# EAGLE design dc (EAGLE 9.2.2)
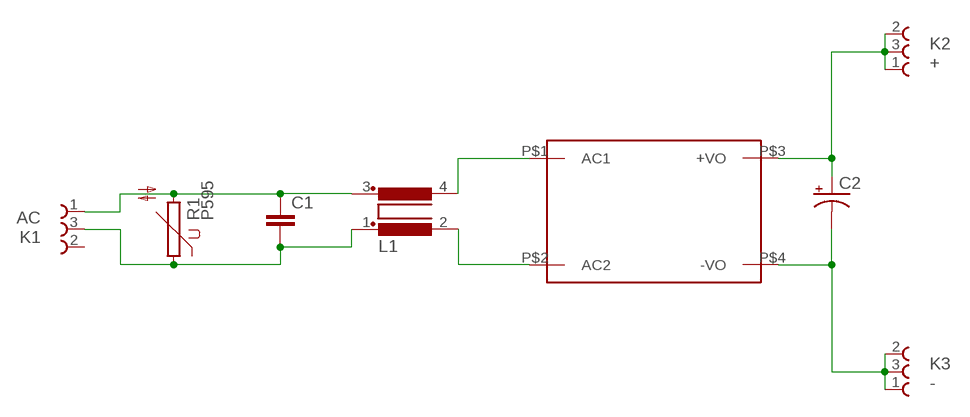
[diagram p0: schematic, sheet 1]

## Parts
C1  C15/7  [C15B7]
C2  CPOL-USE10-20  [EB20D]
K1  AC  691218410003  [691218410003]
K2  +  691218410003  [691218410003]
K3  -  691218410003  [691218410003]
L1  R1003UB5  [B5]
R1  P595  [P595]
U$1  HLK-PM03HLK-20M  [HLK-20M]

## Nets
N$1: C1.1 K1.1 L1.3 R1.2
N$2: L1.4 U$1.P$1(AC1)
N$3: L1.2 U$1.P$2(AC2)
N$4: C1.2 K1.3 L1.1 R1.1
N$5: C2.+ K2.1 K2.2 K2.3 U$1.P$3(+VO)
N$6: C2.- K3.1 K3.2 K3.3 U$1.P$4(-VO)
Unconnected: K1.2

## Library data of the parts
C1 = capacitor-wima:C: CAPACITOR naming: grid - package width
C2 = adafruit:CPOL-US: POLARIZED CAPACITOR, American symbol
K1-K3 = Wurth_Elektronik_Electromechanic_Terminal_Blocks_Connectors_rev15c:691218410003: WR-TBL Serie 2184 - 7.62mm Horizontal Entry Modular with Rising Cage Clamp - 5.3mm2 Wires, 3 Pins=>Code : Con_TBL_Screw_RisingClamp_7.62_691218410003 <http://katalog.we-online.de/media/images/eican/Con_TBL_Screw_RisingClamp_7.62_6912184100xx_pf2.jpg> Details see: http://katalog.we-online.de/en/em/691_218_410_0xx Created 2014-06-18, Karrer Zheng 2014 (C) Würth Elektronik
L1 = inductor-nkl:R1003U: Gleichtakt-Entstördrossel (über typ. 5MHz) common mode choke (above typ.5MHz); OC_FARNELL: unknown; OC_NEWARK: unknown
R1 = varistor:P595: VARISTOR
U$1 = PowerSocket:HLK-PM03

## Board
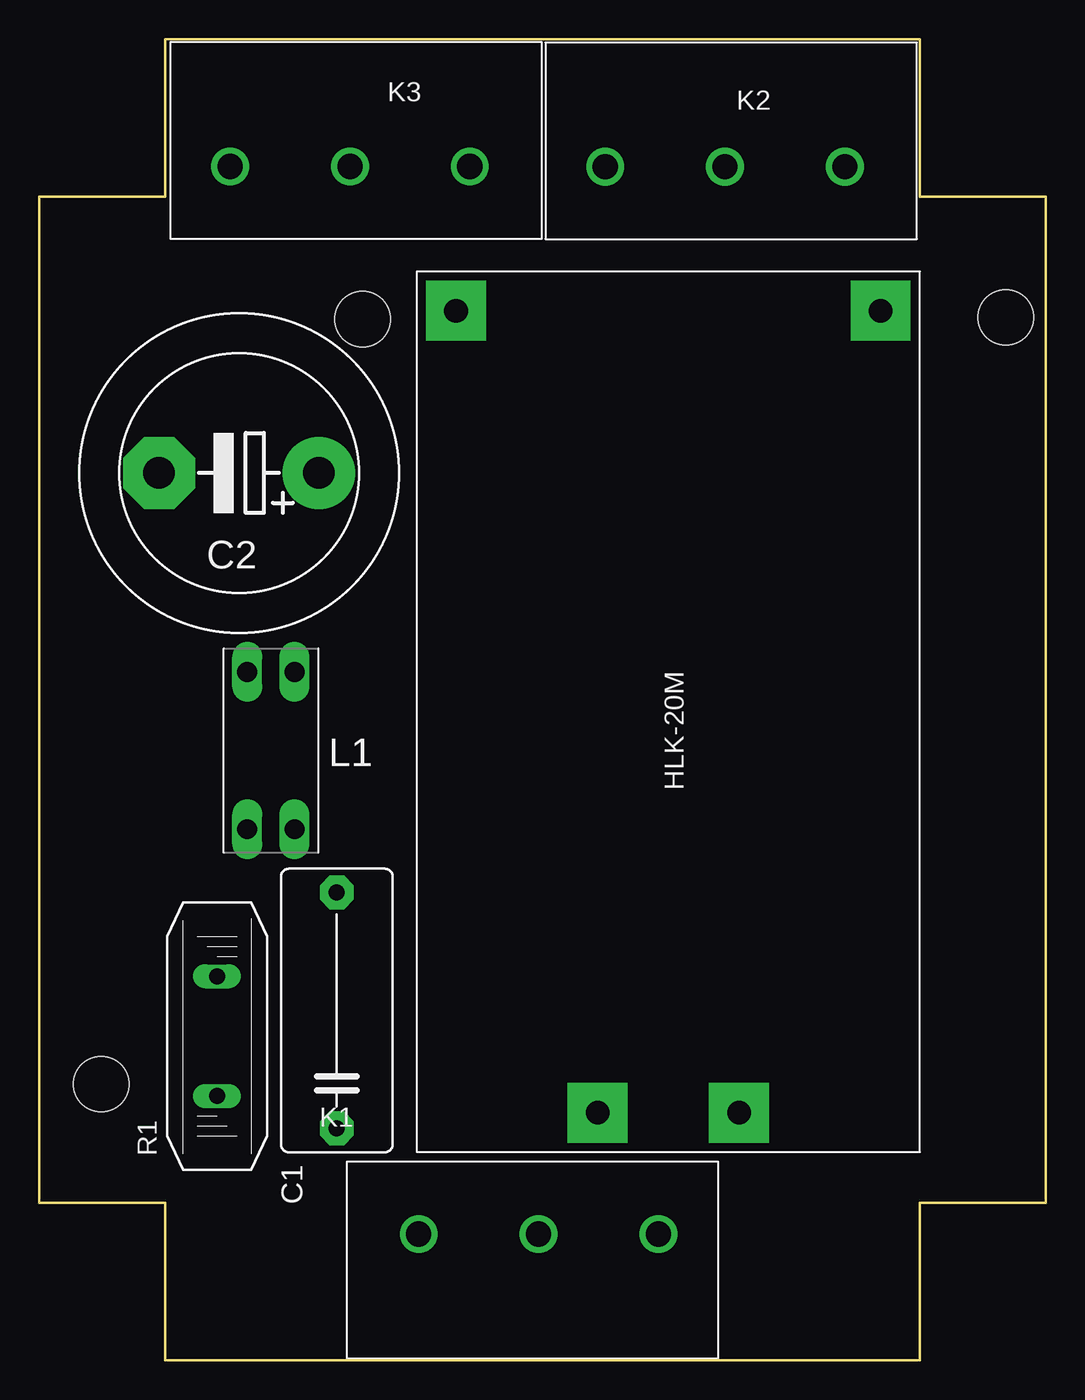
[diagram p1: board, top side]
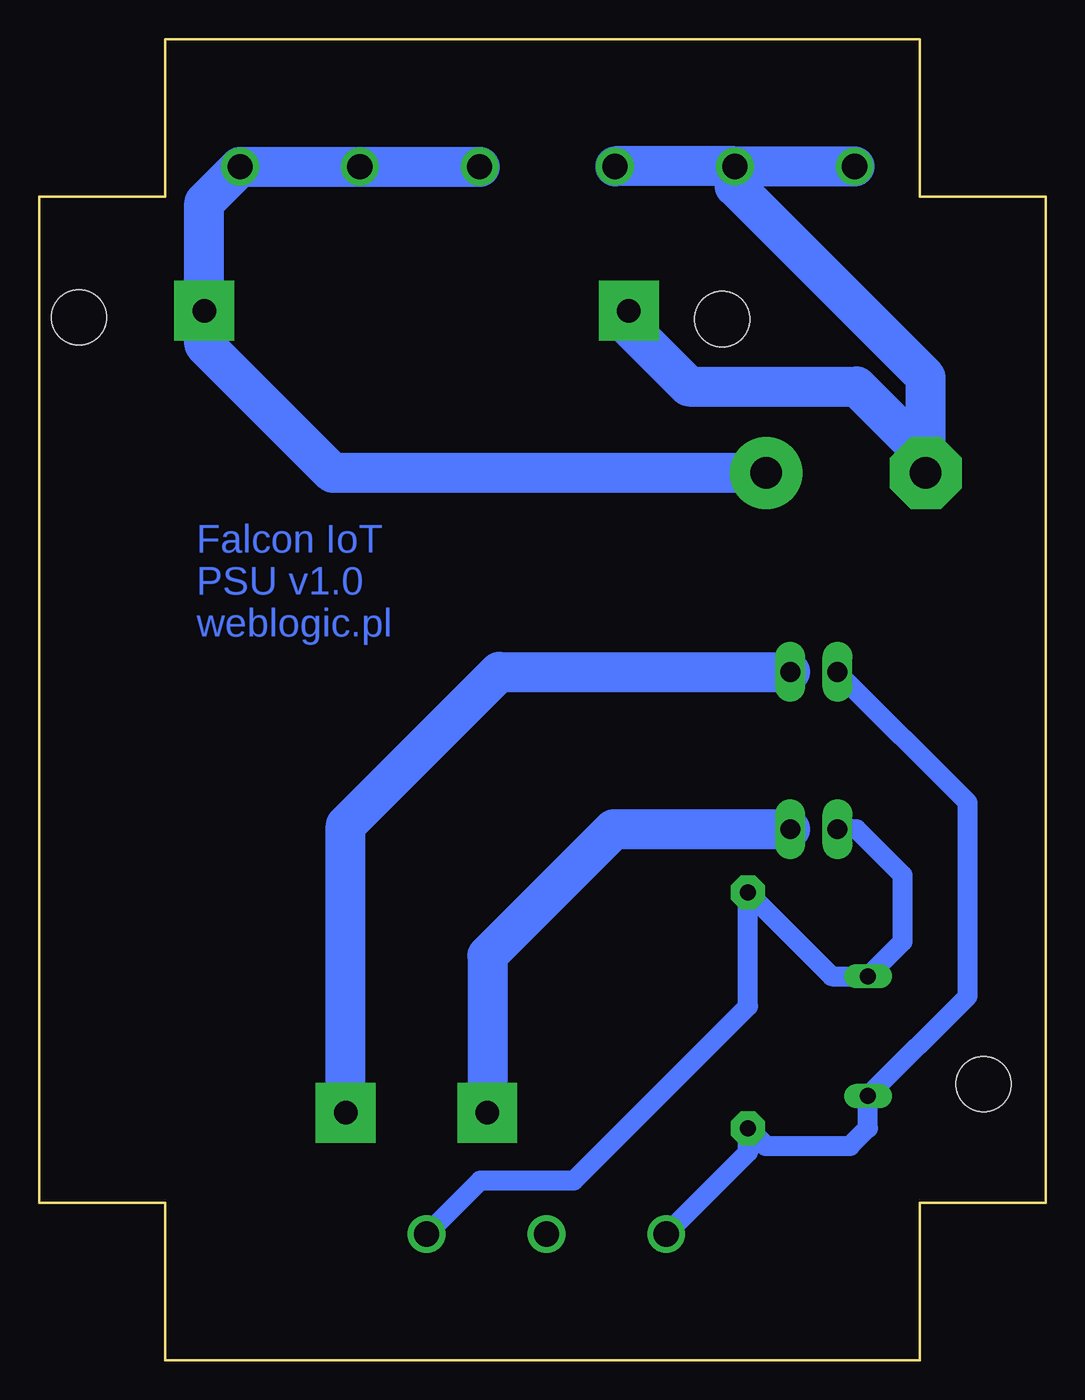
[diagram p2: board, bottom side, seen from below]

Size 64 x 84 mm. Coordinates in mm from the lower left corner, seen from the top.
Outline: 8,0 8,10 0,10 0,74 8,74 8,84 56,84 56,74 64,74 64,10 56,10 56,0 8,0
Copper layers (1*16): Top 0.035mm / dielectric 1.5mm / Bottom 0.035mm
Design rules "default": minimum track width 6mil, minimum drill 0.35mm, track to track 6mil, track to pad 6mil, pad to pad 6mil, via to via 6mil, smd to smd 6mil, copper to edge 40mil, drill to drill 6mil, minimum pad ring 10mil, minimum via ring 8mil, stop-mask expansion 4mil, vias tented up to drill 0mil, thermal gap 10mil
Holes 3.5 mm at 20.56,66.21 3.94,17.57 61.47,66.33

### Footprints (pad centres in the part's own frame; a part is rotated, then mirrored left to right if it is on the bottom)
C15B7 = drill 1.016 pad 2.159 octagon: 1 -7.493,0; 2 7.493,0
EB20D = drill 2.007 pad 4.597: + -5.08,0 | drill 2.007 pad 4.597 octagon: - 5.08,0
691218410003 = drill 1.6: 1 -7.62,0; 2 0,0; 3 7.62,0
B5 = drill 1.27 long: 1 -5,1.5; 2 -5,-1.5; 3 5,1.5; 4 5,-1.5
P595 = drill 1.016 long: 1 0,3.81; 2 0,-3.81
HLK-20M = drill 1.5 pad 3.81 square: P$1 2.5,11.5; P$2 2.5,20.5; P$3 53.5,2.5; P$4 53.5,29.5

### Placement (x,y rotation side)
C1  18.92,22.24 90 top
C2  12.7,56.42 180 top
K1  31.75,8.02 0 top
K2  43.61,75.89 180 top
K3  19.76,75.92 180 top
L1  14.73,38.77 90 top
R1  11.3,20.61 0 top
U$1  56.01,13.24 90 top

### Tracks (layer width: path | path; a pad name or v marks a point on that pad's centre or on a via)
N$1
  Bottom 1.27: K1.1 18.92,13.22 C1.1 17.8,13.62 12.45,13.62 11.3,14.76 R1.2 4.95,23.15 4.95,35.47 13.23,43.74 L1.3
N$2
  Bottom 2.54: U$1.P$1 44.51,34.01 34.75,43.77 L1.4
N$3
  Bottom 2.54: L1.2 27.48,33.77 35.51,25.74 U$1.P$2
N$4
  Bottom 1.27: K1.3 35.95,11.44 30,11.44 18.92,22.51 C1.2 13.61,24.42 R1.1 9.09,26.63 9.09,30.84 12.02,33.77 L1.1
N$5
  Bottom 2.54: K2.3 K2.2 K2.1 53.51,73.62 U$1.P$3 53.51,64.59 45.34,56.42 C2.+
N$6
  Bottom 2.54: U$1.P$4 26.51,65.74 22.69,61.92 12.02,61.92 7.62,57.52 C2.- 7.62,62.52 19.76,74.66 K3.2 | K3.2 K3.3 | K3.2 K3.1

### Text on the board
Bottom: Falcon IoT / PSU v1.0 / weblogic.pl